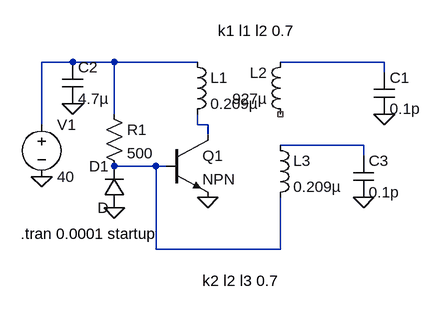
[diagram p0: schematic Coupling3inductorsforNonContactfeedbackToBaseDriveOfTransistor.asc]
Coupling3inductorsforNonContactfeedbackToBaseDriveOfTransistor.asc, the LTspice schematic file:
Version 4.1
SHEET 1 880 680
WIRE -32 64 -80 64
WIRE 32 64 -32 64
WIRE 160 64 32 64
WIRE 448 64 288 64
WIRE 448 80 448 64
WIRE 32 144 32 64
WIRE -80 160 -80 64
WIRE 160 160 160 144
WIRE 176 160 160 160
WIRE 176 176 176 160
WIRE 416 192 288 192
WIRE 416 208 416 192
WIRE 96 224 32 224
WIRE 112 224 96 224
WIRE 96 352 96 224
WIRE 288 352 288 272
WIRE 288 352 96 352
FLAG -80 240 0
FLAG -32 128 0
FLAG 176 272 0
FLAG 32 288 0
FLAG 416 272 0
FLAG 448 144 0
SYMBOL ind 144 48 R0
SYMATTR InstName L1
SYMATTR Value 0.209µ
SYMATTR Type ind
SYMBOL res 16 128 R0
SYMATTR InstName R1
SYMATTR Value 500
SYMBOL voltage -80 144 R0
WINDOW 123 0 0 Left 0
WINDOW 39 0 0 Left 0
SYMATTR InstName V1
SYMATTR Value 40
SYMBOL cap -48 64 R0
SYMATTR InstName C2
SYMATTR Value 4.7µ
SYMBOL npn 112 176 R0
SYMATTR InstName Q1
SYMBOL ind 304 160 R180
WINDOW 0 36 80 Left 2
WINDOW 3 36 40 Left 2
SYMATTR InstName L2
SYMATTR Value 927µ
SYMATTR Type ind
SYMBOL diode 48 288 R180
WINDOW 0 24 64 Left 2
WINDOW 3 24 0 Left 2
SYMATTR InstName D1
SYMBOL cap 400 208 R0
SYMATTR InstName C3
SYMATTR Value 0.1p
SYMBOL ind 272 176 R0
SYMATTR InstName L3
SYMATTR Value 0.209µ
SYMATTR Type ind
SYMBOL cap 432 80 R0
SYMATTR InstName C1
SYMATTR Value 0.1p
TEXT -112 328 Left 2 !.tran 0.0001 startup
TEXT 192 16 Left 2 !k1 l1 l2 0.7
TEXT 168 400 Left 2 !k2 l2 l3 0.7

The netlist it stands for:
* Coupling3inductorsforNonContactfeedbackToBaseDriveOfTransistor.asc
L1 N001 N003 0.209µ
R1 N001 N005 500
V1 N001 0 40
C2 N001 0 4.7µ
Q1 N003 N005 0 0 NPN
L2 NC_01 N002 927µ
D1 0 N005 D
C3 N004 0 0.1p
L3 N004 N005 0.209µ
C1 N002 0 0.1p
.model D D
.lib standard.dio
.model NPN NPN
.model PNP PNP
.lib standard.bjt
.tran 0.0001 startup
k1 l1 l2 0.7
k2 l2 l3 0.7
.backanno
.end